# Altium project TemperatureZB.PrjPCB
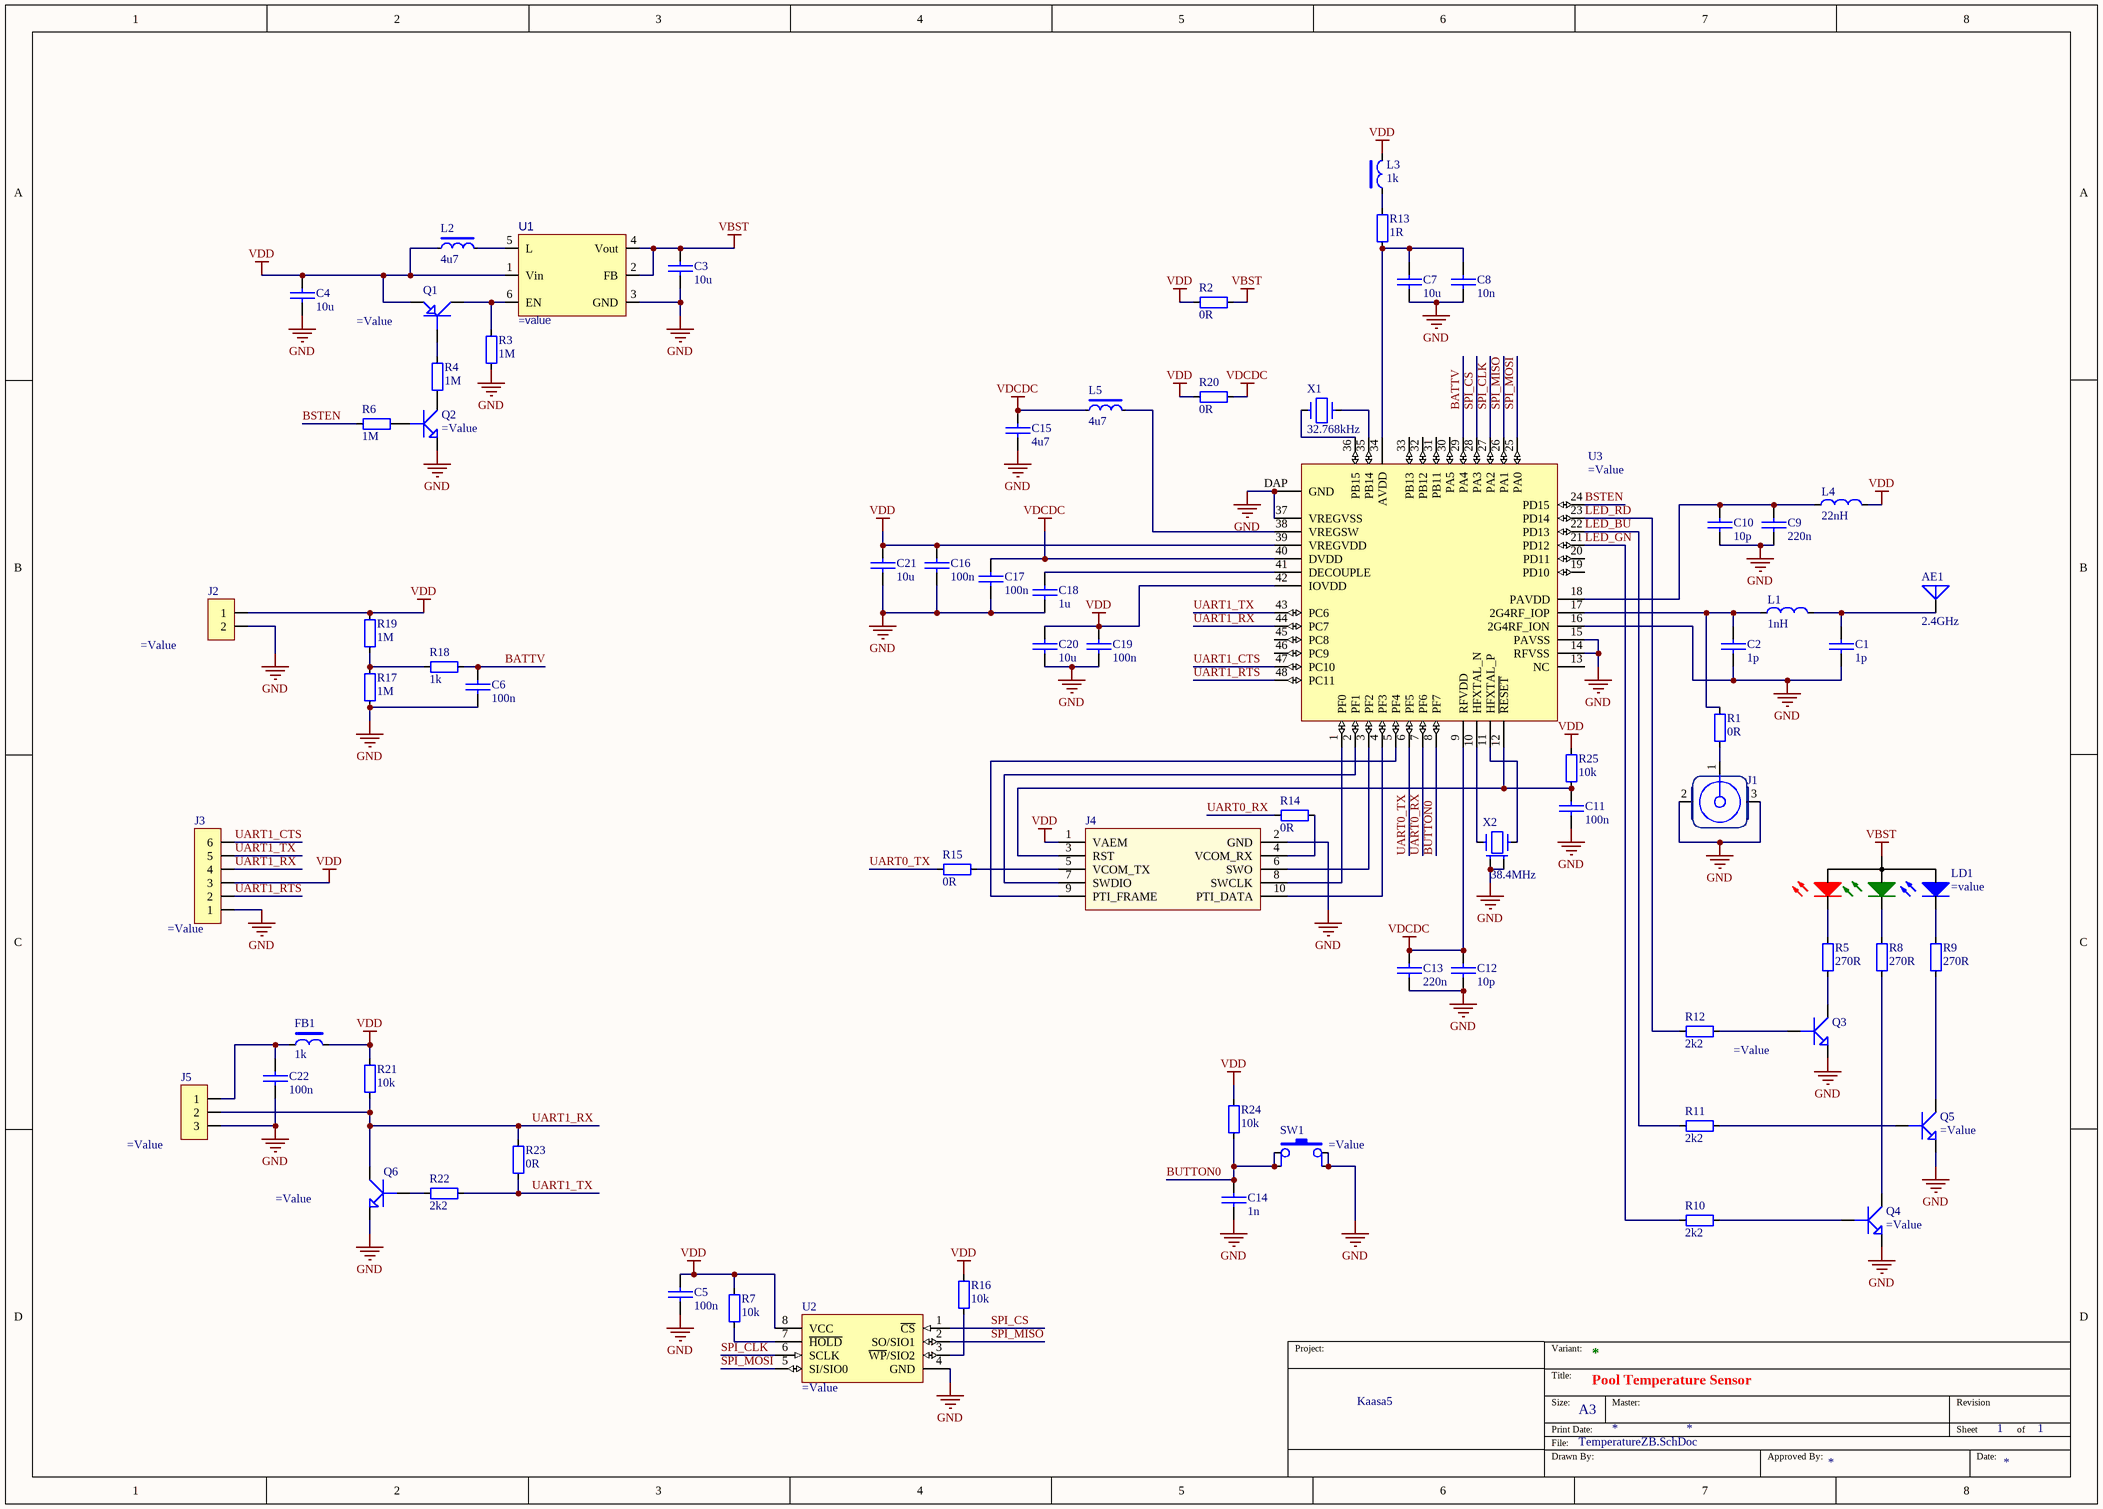
[diagram p0: TemperatureZB.SchDoc]
Drawn By:: Nathan Kuchel
1 sheet, 72 parts. Net scope: global (net labels, ports and power ports of the same name join across sheets).
Board file: TemperatureZB.PcbDoc

## Sheet TemperatureZB.SchDoc: Pool Temperature Sensor
size A3; CompanyName: Kaasa5; DrawnBy: Nathan Kuchel; Organization: Kaasa5; Address1: 1 Chardonnay Blvd; Address2: Reynella, SA, 5161; Revision: 1.0.0; SheetNumber: 1; SheetTotal: 1; SheetTitle: Pool Temperature Sensor

### Parts
AE1  2.4GHz  [ANT2450AT45A100]
C1  1p  [CAPC1005X06N]
C2  1p  [CAPC1005X06N]
C3  10u  [CAPC1005X06N]
C4  10u  [CAPC1005X06N]
C5  100n  [CAPC1005X06N]
C6  100n  [CAPC1005X06N]
C7  10u  [CAPC1005X06N]
C8  10n  [CAPC1005X06N]
C9  220n  [CAPC1005X06N]
C10  10p  [CAPC1005X06N]
C11  100n  [CAPC1005X06N]
C12  10p  [CAPC1005X06N]
C13  220n  [CAPC1005X06N]
C14  1n  [CAPC1005X06N]
C15  4u7  [CAPC1608X09N]
C16  100n  [CAPC1005X06N]
C17  100n  [CAPC1005X06N]
C18  1u  [CAPC1005X06N]
C19  100n  [CAPC1005X06N]
C20  10u  [CAPC1005X06N]
C21  10u  [CAPC1005X06N]
C22  100n  [CAPC1005X06N]
FB1  1k  [INDC1005X06N]
J1  (no value)  [U.FL-LP(V)-040]
J2  (no value)  [S2B-PH-SM4-TB]
J3  (no value)  [HDR1X6]
J4  (no value)  [HDR127MM2X5(noPilot)]  (no BOM)
J5  (no value)  [S3B-PH-SM4-TB]
L1  1nH  [INDC1005X06N]
L2  4u7  [INDC2020X12N]
L3  1k  [INDC1005X06N]
L4  22nH  [INDC1005X06N]
L5  4u7  [INDC2020X12N]
LD1  (no value)  [LEDM3528X190-4N]
Q1  (no value)  [SOT95P230X110-3N]
Q2  (no value)  [SOT95P230X110-3N]
Q3  (no value)  [SOT95P230X110-3N]
Q4  (no value)  [SOT95P230X110-3N]
Q5  (no value)  [SOT95P230X110-3N]
Q6  (no value)  [SOT95P230X110-3N]
R1  0R  [RESC1005X04N]
R2  0R  [RESC1005X04N]
R3  1M  [RESC1005X04N]
R4  1M  [RESC1005X04N]
R5  270R  [RESC1005X04N]
R6  1M  [RESC1005X04N]
R7  10k  [RESC1005X04N]
R8  270R  [RESC1005X04N]
R9  270R  [RESC1005X04N]
R10  2k2  [RESC1005X04N]
R11  2k2  [RESC1005X04N]
R12  2k2  [RESC1005X04N]
R13  1R  [RESC1005X04N]
R14  0R  [RESC1005X04N]
R15  0R  [RESC1005X04N]
R16  10k  [RESC1005X04N]
R17  1M  [RESC1005X04N]
R18  1k  [RESC1005X04N]
R19  1M  [RESC1005X04N]
R20  0R  [RESC1005X04N]
R21  10k  [RESC1005X04N]
R22  2k2  [RESC1005X04N]
R23  0R  [RESC1005X04N]
R24  10k  [RESC1005X04N]
R25  10k  [RESC1005X04N]
SW1  (no value)  [SW450P600x600-4N]
U1  (no value)  [SOT363-6N]
U2  (no value)  [SOIC127P600X175-8N]
U3  (no value)  [QFN50P700X700X80-4846N]
X1  32.768kHz  [XTAL32X15X09]
X2  38.4MHz  [LCCS185P320X250X80-4N]

### Nets
GND: C1.2 C2.2 C3.1 C4.1 C5.2 C6.2 C7.1 C8.2 C9.2 C10.2 C11.2 C12.2 C13.2 C14.2 C15.1 C16.1 C17.2 C18.2 C19.2 C20.2 C21.2 C22.2 J1.2(GND) J1.3(GND) J2.2 J3.1 J4.2(GND) J5.3 Q2.2(E) Q3.2(E) Q4.2(E) Q5.2(E) Q6.2(E) R3.2 R17.1 SW1.2 SW1.4 U1.3(GND) U2.4(GND) U3.14(RFVSS) U3.15(PAVSS) U3.16(2G4RF_ION) U3.37(VREGVSS) U3.DAP(GND) X2.2 X2.4
VBST: C3.2 LD1.4(COM_A) R2.1 U1.2(FB) U1.4(Vout)
VDCDC: C12.1 C13.1 C15.2 C17.1 L5.1 R20.1 U3.9(RFVDD) U3.40(DVDD)
VDD: C4.2 C5.1 C16.2 C19.1 C20.1 C21.1 FB1.1 J2.1 J3.3 J4.1(VAEM) L2.1 L3.2 L4.2 Q1.2(E) R2.2 R7.2 R16.2 R19.2 R20.2 R21.2 R24.1 R25.2 U1.1(Vin) U2.8(VCC) U3.39(VREGVDD) U3.42(IOVDD)
BATTV: C6.1 R18.2 U3.29(PA4)
BSTEN: R6.1 U3.24(PD15)
BUTTON0: C14.1 R24.2 SW1.1 SW1.3 U3.8(PF7)
LED_BU: R11.1 U3.22(PD13)
LED_GN: R10.1 U3.21(PD12)
LED_RD: R12.1 U3.23(PD14)
SPI_CLK: U2.6(SCLK) U3.27(PA2)
SPI_CS: U2.1(~{CS}) U3.28(PA3)
SPI_MISO: U2.2(SO/SIO1) U3.26(PA1)
SPI_MOSI: U2.5(SI/SIO0) U3.25(PA0)
UART0_RX: R14.2 U3.7(PF6)
UART0_TX: R15.1 U3.6(PF5)
UART1_CTS: J3.6 U3.47(PC10)
UART1_RTS: J3.2 U3.48(PC11)
UART1_RX: J3.4 J5.2 Q6.3(C) R21.1 R23.2 U3.44(PC7)
UART1_TX: J3.5 R22.1 R23.1 U3.43(PC6)
NetAE1_1: AE1.1 C1.1 L1.2
NetC2_1: C2.1 L1.1 R1.1 U3.17(2G4RF_IOP)
NetC7_2: C7.2 C8.1 R13.1 U3.34(AVDD)
NetC9_1: C9.1 C10.1 L4.1 U3.18(PAVDD)
NetC11_1: C11.1 J4.3(RST) R25.1 U3.12(~{RESET})
NetC18_1: C18.1 U3.41(DECOUPLE)
NetC22_1: C22.1 FB1.2 J5.1
NetJ1_1: J1.1(Signal) R1.2
NetJ4_4: J4.4(VCOM_RX) R14.1
NetJ4_5: J4.5(VCOM_TX) R15.2
NetJ4_6: J4.6(SWO) U3.3(PF2)
NetJ4_7: J4.7(SWDIO) U3.2(PF1)
NetJ4_8: J4.8(SWCLK) U3.1(PF0)
NetJ4_9: J4.9(PTI_FRAME) U3.5(PF4)
NetJ4_10: J4.10(PTI_DATA) U3.4(PF3)
NetL2_2: L2.2 U1.5(L)
NetL3_1: L3.1 R13.2
NetL5_2: L5.2 U3.38(VREGSW)
NetLD1_1: LD1.1(K_RD) R5.1
NetLD1_2: LD1.2(K_GR) R8.1
NetLD1_3: LD1.3(K_BU) R9.1
NetQ1_1: Q1.1(B) R4.2
NetQ1_3: Q1.3(C) R3.1 U1.6(EN)
NetQ2_1: Q2.1(B) R6.2
NetQ2_3: Q2.3(C) R4.1
NetQ3_1: Q3.1(B) R12.2
NetQ3_3: Q3.3(C) R5.2
NetQ4_1: Q4.1(B) R10.2
NetQ4_3: Q4.3(C) R8.2
NetQ5_1: Q5.1(B) R11.2
NetQ5_3: Q5.3(C) R9.2
NetQ6_1: Q6.1(B) R22.2
NetR7_1: R7.1 U2.7(~{HOLD})
NetR16_1: R16.1 U2.3(~{WP}/SIO2)
NetR17_2: R17.2 R18.1 R19.1
NetU3_10: U3.10(HFXTAL_N) X2.3
NetU3_11: U3.11(HFXTAL_P) X2.1
NetU3_35: U3.35(PB14) X1.2
NetU3_36: U3.36(PB15) X1.1

Not connected (* = marked no-connect by the designer): U3 13(NC) 19(PD10) 20(PD11) 30(PA5) 31(PB11) 32(PB12) 33(PB13) 45(PC8) 46(PC9)

### Notes on the sheet
- Project:
- Variant:
- Title:
- File:
- Drawn By:
- Print Date:
- Size:
- A3
- Master:
- Approved By:
- Sheet
- Revision
- Date:
- of

### Library data of the parts
AE1 = 2450AT45A100E: ANT SMD CER 1dB 3808; Manufacturer: Johanson Technology Inc.; Value: 2.4GHz; ComponentLink1URL: https://www.johansontechnology.com/datasheets/2450AT45A100/2450AT45A100.pdf; ComponentLink1Description: Datasheet; Supplier 1: DigiKey; Supplier Part Number 1: 712-1012-1-ND; PartId: 23; Part Number: 2450AT45A100E; Price: 1.54; PartStatus: Standard
C1 C2 = CC0402BRNPO9BN1R0: CAP SMD CER C0G/NPO ±0.1p 50V 0402; Manufacturer: Yageo; Value: 1p; ComponentLink1URL: www.yageo.com/documents/recent/UPY-GP_NP0_16V-to-50V_17.pdf; ComponentLink1Description: Datasheet; Supplier 1: Element14; Part Number: CC0402BRNPO9BN1R0; PartId: 19; Supplier Part Number 1: 311-3613-1-ND; Price: 0.0226; PartStatus: Standard
C3 C4 C7 C20 C21 = GRM155R60J106ME15D: CAP SMD CER X5R 20% 6.3V 0402; Manufacturer: Murata Electronics; Value: 10u; ComponentLink1URL: https://psearch.en.murata.com/capacitor/product/GRM155R60J106ME15%23.pdf; ComponentLink1Description: Datasheet; Supplier 1: DigiKey; Supplier Part Number 1: 490-13238-1-ND; Part Number: GRM155R60J106ME15D; PartId: 6; Price: 0.235; PartStatus: Standard
C5 C6 C11 C16 C17 C19 C22 = CC0402KRX7R7BB104: CAP SMD CER X7R 10% 16V 0402; Manufacturer: Yageo; Value: 100n; ComponentLink1URL: http://www.yageo.com/documents/recent/UPY-GPHC_X7R_6.3V-to-50V_18.pdf; ComponentLink1Description: Datasheet; Supplier 1: DigiKey; Supplier Part Number 1: 311-1338-1-ND; Part Number: CC0402KRX7R7BB104; PartId: 9; Price: 0.0213; PartStatus: Standard
C8 = CC0402KRX7R9BB103: CAP SMD CER X7R 10% 50V 0402; Manufacturer: Yageo; Value: 10n; ComponentLink1URL: http://www.yageo.com/documents/recent/UPY-GPHC_X7R_6.3V-to-50V_18.pdf; ComponentLink1Description: Datasheet; Supplier 1: DigiKey; Supplier Part Number 1: 311-1349-1-ND; Part Number: CC0402KRX7R9BB103; PartId: 10; Price: 0.0129; PartStatus: Standard
C9 C13 = CL05B224KO5NNNC: CAP SMD CER X7R 10% 16V 0402; Manufacturer: Samsung Electro-Mechanics; Value: 220n; ComponentLink1URL: http://www.samsungsem.com/kr/support/product-search/mlcc/__icsFiles/afieldfile/2019/06/18/CL05B224KO5NNNC-19.pdf; ComponentLink1Description: Datasheet; Supplier 1: DigiKey; Supplier Part Number 1: 1276-1176-1-ND; Part Number: CL05B224KO5NNNC; PartId: 20; Price: 0.0397; PartStatus: Standard
C10 C12 = CC0402JRNPO9BN100: CAP SMD CER C0G/NPO 5% 50V 0402; Manufacturer: Yageo; Value: 10p; ComponentLink1URL: www.yageo.com/documents/recent/UPY-GP_NP0_16V-to-50V_17.pdf; ComponentLink1Description: Datasheet; Supplier 1: DigiKey; Supplier Part Number 1: 311-1014-1-ND; Part Number: CC0402JRNPO9BN100; PartId: 18; Price: 0.0192; PartStatus: Standard
C14 = GRM1555C1H102JA01D: CAP SMD CER C0G/NPO 5% 50V 0402; Manufacturer: Murata Electronics; Value: 1n; ComponentLink1URL: https://search.murata.co.jp/Ceramy/image/img/A01X/G101/ENG/GRM1555C1H102JA01-01.pdf; ComponentLink1Description: Datasheet; Supplier 1: DigiKey; Part Number: GRM1555C1H102JA01D; PartId: 12; Supplier Part Number 1: 490-3244-1-ND; Price: 0.118; PartStatus: Standard
C15 = CL10B475KQ8NQNC: CAP SMD CER X7R 10% 6V3 0603; Manufacturer: Samsung Electro-Mechanics; Value: 4u7; ComponentLink1URL: https://media.digikey.com/pdf/Data%20Sheets/Samsung%20PDFs/CL_Series_MLCC_ds.pdf; ComponentLink1Description: Datasheet; Supplier 1: DigiKey; Supplier Part Number 1: 1276-2087-1-ND; Part Number: CL10B475KQ8NQNC; PartId: 41; Price: 0.197; PartStatus: Standard
C18 = GRM155R70J105KA12J: CAP SMD CER X7R 10% 6.3V 0402; Manufacturer: Murata Electronics; Value: 1u; ComponentLink1URL: https://search.murata.co.jp/Ceramy/image/img/A01X/G101/ENG/GRM155R70J105KA12-01.pdf; ComponentLink1Description: Datasheet; Supplier 1: DigiKey; Supplier Part Number 1: 490-13339-1-ND; Part Number: GRM155R70J105KA12J; PartId: 8; Price: 0.0554; PartStatus: Standard
FB1 L3 = BK1005HS102-T: FER BEAD SMD ±25% 300mA 0402; Manufacturer: Taiyo Yuden; Part Number: BK1005HS102-T; PartId: 11; Value: 1k; ComponentLink1Description: Datasheet; ComponentLink1URL: https://www.yuden.co.jp/productdata/catalog/mlci07_e.pdf; Supplier 1: DigiKey; Supplier Part Number 1: 587-1841-1-ND; Price: 0.0494; PartStatus: Standard
J1 = 1909763-1: CON SMD VERT RF U.FL; Manufacturer: TE Connectivity AMP Connectors; Part Number: 1909763-1; PartId: 42; Value: 1909763-1; ComponentLink1Description: Datasheet; ComponentLink1URL: https://www.te.com/commerce/DocumentDelivery/DDEController?Action=srchrtrv&DocNm=1909763&DocType=Customer+Drawing&DocLang=English; Supplier 1: DigiKey; Supplier Part Number 1: A118077CT-ND; Price: 0.43; PartStatus: Standard
J2 = S2B-PH-SM4-TB(LF)(SN): CON SMD RIGHT ANGLE 100V 2A 2x5pin; Manufacturer: JST Sales America Inc.; PartId: 37; Value: S2B-PH-SM4-TB(LF)(SN); Part Number: S2B-PH-SM4-TB(LF)(SN); ComponentLink1Description: Datasheet; ComponentLink1URL: http://www.jst-mfg.com/product/pdf/eng/ePH.pdf; Supplier 1: DigiKey; Supplier Part Number 1: 455-1749-1-ND; Price: 0.89; PartStatus: Standard
J3 = 68000-406HLF: CON THRU Vertical 1A Header 1x6pin; Manufacturer: Amphenol 87; Part Number: 68000-406HLF; PartId: 43; Value: 68000-406HLF; ComponentLink1Description: Datasheet; ComponentLink1URL: https://cdn.amphenol-icc.com/media/wysiwyg/files/drawing/68000.pdf; Supplier 1: DigiKey; Supplier Part Number 1: 609-3263-ND; Price: 0.375; PartStatus: Standard
J4 = GRPB052VWQS-RC: CON SMD 1A 2x5pin; Manufacturer: Sullins Connector Solutions; Value: SIMPLICITY_Debug; ComponentLink1URL: https://s3.amazonaws.com/catalogspreads-pdf/PAGE94-95%20.050%20MALE%20HDR%20ST%20RA%20SMT.pdf; ComponentLink1Description: Datasheet; Supplier 1: DigiKey; Part Number: GRPB052VWQS-RC; PartId: 25; ComponentLink2Description: Drawing; ComponentLink2URL: https://drawings-pdf.s3.amazonaws.com/10958.pdf; Supplier Part Number 1: S9012E-05-ND; Price: 1.57; PartStatus: Standard
J5 = S3B-PH-SM4-TB(LF)(SN): CON SMD RIGHT ANGLE 100V 2A Header 1x3pin; Manufacturer: JST Sales America Inc.; Part Number: S3B-PH-SM4-TB(LF)(SN); PartId: 44; Value: S3B-PH-SM4-TB(LF)(SN); ComponentLink1Description: Datasheet; ComponentLink1URL: http://www.jst-mfg.com/product/pdf/eng/ePH.pdf; Supplier 1: DigiKey; Supplier Part Number 1: 455-1750-1-ND; Price: 1.05; PartStatus: Standard
L1 = AISC-0402-1N0J-T: IND SMD UnShielded W/W 5% 1.36A 0402; Manufacturer: Abracon LLC; Value: 1nH; ComponentLink1URL: https://abracon.com/Magnetics/new/AISC-0402.pdf; ComponentLink1Description: Datasheet; Supplier 1: DigiKey; Supplier Part Number 1: 535-10423-1-ND; Part Number: AISC-0402-1N0J-T; PartId: 22; ComponentLink2URL: https://abracon.com/Support/PackageDrawing/Magnetics/AISC-0402.PDF; Price: 0.51; PartStatus: Standard
L2 L5 = NRV2012T4R7MGF: IND SMD UnShielded W/W 5% 750mA 2010; Manufacturer: Taiyo Yuden; PartId: 40; Value: 4u7; Part Number: NRV2012T4R7MGF; ComponentLink1Description: Datasheet; ComponentLink1URL: https://www.yuden.co.jp/productdata/catalog/wound04_e.pdf; Supplier 1: DigiKey; Supplier Part Number 1: 587-4705-1-ND; Price: 0.359; PartStatus: Standard
L4 = LQG15HS22NJ02D: IND SMD UnShielded Multi-Layer 5% 350mA 0402; Manufacturer: Murata Electronics; Value: 22nH; ComponentLink1URL: https://psearch.en.murata.com/inductor/product/LQG15HS22NJ02_.pdf; ComponentLink1Description: Datasheet; Supplier 1: DigiKey; Supplier Part Number 1: 490-2627-1-ND; Part Number: LQG15HS22NJ02D; PartId: 21; ComponentLink2Description: Catalogue; ComponentLink2URL: https://search.murata.co.jp/Ceramy/image/img/P02/JELF243B-0010.pdf; Price: 0.091; PartStatus: Standard
LD1 = ASMB-MTB1-0A3A2: LED SMD 540mcd Red, 1600mcd Green, 350mcd Blue 4PLCC; Manufacturer: Broadcom Limited; Value: ASMB-MTB1-0A3A2; ComponentLink1URL: https://docs.broadcom.com/docs/AV02-4194EN; ComponentLink1Description: Datasheet; Supplier 1: DigiKey; PartId: 28; Part Number: ASMB-MTB1-0A3A2; Supplier Part Number 1: 516-3280-1-ND; Price: 0.94; PartStatus: Standard
Q1 = MMBT3906,215: TRANS SMD BJT PNP 40V 0.2A SOT23; Manufacturer: Nexperia USA Inc.; PartId: 30; Value: MMBT3906,215; Part Number: MMBT3906,215; ComponentLink1Description: Datasheet; ComponentLink1URL: https://assets.nexperia.com/documents/data-sheet/MMBT3906.pdf; Supplier 1: DigiKey; Supplier Part Number 1: 1727-4045-1-ND; Price: 0.191; PartStatus: Standard
Q2-Q6 = MMBT3904,215: TRANS SMD BJT NPN 40V 0.2A SOT23; Manufacturer: Nexperia USA Inc.; Value: MMBT3904,215; ComponentLink1URL: https://assets.nexperia.com/documents/data-sheet/MMBT3904.pdf; ComponentLink1Description: Datasheet; Supplier 1: DigiKey; Supplier Part Number 1: 1727-4044-1-ND; PartId: 29; Part Number: MMBT3904,215; Price: 0.145; PartStatus: Standard
R1 R2 R14 R15 R20 R23 = RC0402FR-070RL: RES SMD Think Film 1% 1/16W 1A 100V 0402; Manufacturer: Yageo; Value: 0R; ComponentLink1URL: http://www.yageo.com/documents/recent/PYu-RC_Group_51_RoHS_L_10.pdf; ComponentLink1Description: Datasheet; Supplier 1: DigiKey; Supplier Part Number 1: 311-0.0LRCT-ND; Part Number: RC0402FR-070RL; PartId: 17; Price: 0.009; PartStatus: Standard
R3 R4 R6 R17 R19 = RC0402FR-071ML: RES SMD Think Film 1% 1/16W 50V 0402; Manufacturer: Yageo; Value: 1M; ComponentLink1URL: http://www.yageo.com/documents/recent/PYu-RC_Group_51_RoHS_L_10.pdf; ComponentLink1Description: Datasheet; Supplier 1: DigiKey; Supplier Part Number 1: 311-1.00MLRCT-ND; Part Number: RC0402FR-071ML; PartId: 38; Price: 0.0102; PartStatus: Standard
R5 R8 R9 = RC0402FR-07270RL: RES SMD Think Film 1% 1/16W 100V 0402; Manufacturer: Yageo; Value: 270R; ComponentLink1URL: http://www.yageo.com/documents/recent/PYu-RC_Group_51_RoHS_L_10.pdf; ComponentLink1Description: Datasheet; Supplier 1: DigiKey; Supplier Part Number 1: 311-270LRCT-ND; Part Number: RC0402FR-07270RL; PartId: 16; Price: 0.01; PartStatus: Standard
R7 R16 R21 R24 R25 = RC0402FR-0710KL: RES SMD Think Film 1% 1/16W 100V 0402; Manufacturer: Yageo; Value: 10k; ComponentLink1URL: http://www.yageo.com/documents/recent/PYu-RC_Group_51_RoHS_L_10.pdf; ComponentLink1Description: Datasheet; Supplier 1: DigiKey; Supplier Part Number 1: 311-10.0KLRCT-ND; Part Number: RC0402FR-0710KL; PartId: 4; Price: 0.01; PartStatus: Standard
R10-R12 R22 = RC0402FR-072K2L: RES SMD Think Film 1% 1/16W 50V 0402; Manufacturer: Yageo; PartId: 31; Value: 2k2; Part Number: RC0402FR-072K2L; ComponentLink1Description: Datasheet; ComponentLink1URL: http://www.yageo.com/documents/recent/PYu-RC_Group_51_RoHS_L_10.pdf; Supplier 1: DigiKey; Supplier Part Number 1: 311-2.20KLRCT-ND; Price: 0.102; PartStatus: Standard
R13 = RC0402FR-071RL: RES SMD Think Film 1% 1/16W 100V 0402; Manufacturer: Yageo; Value: 1R; ComponentLink1URL: http://www.yageo.com/documents/recent/PYu-RC_Group_51_RoHS_L_10.pdf; ComponentLink1Description: Datasheet; Supplier 1: DigiKey; Supplier Part Number 1: 311-1.00LRCT-ND; Part Number: RC0402FR-071RL; PartId: 5; Price: 0.0151; PartStatus: Standard
R18 = RC0402FR-071KL: RES SMD Think Film 1% 1/16W 100V 0402; Manufacturer: Yageo; Part Number: RC0402FR-071KL; PartId: 1; Value: 1k; ComponentLink1Description: Datasheet; ComponentLink1URL: http://www.yageo.com/documents/recent/PYu-RC_Group_51_RoHS_L_10.pdf; Supplier 1: DigiKey; Supplier Part Number 1: 311-1.00KLRCT-ND; Price: 0.01; PartStatus: Standard
SW1 = PTS645SK50SMTR92 LFS: SWITCH SMD TACTILE PUSH BUTTON SPST-NO 12V 50mA GULLWING; Manufacturer: C&K Components; PartId: 45; Value: PTS645SK50SMTR92 LFS; Part Number: PTS645SK50SMTR92 LFS; ComponentLink1Description: Datasheet; ComponentLink1URL: https://www.ckswitches.com/products/tactile/PTS645/PTS645SK50SMTR92LFS; Supplier 1: DigiKey; Supplier Part Number 1: CKN9087CT-ND; Price: 0.4; PartStatus: Standard
U1 = TPS61222DCKR: IC SMD BOOST CONV 5V 200mA SC70-6; Manufacturer: Texas Instruments; Part Number: TPS61222DCKR; PartId: 36; Value: TPS61222DCKR; ComponentLink1Description: Datasheet; ComponentLink1URL: http://www.ti.com/lit/ds/symlink/tps61220.pdf; Supplier 1: DigiKey; Supplier Part Number 1: 296-39435-1-ND; Price: 1.74; PartStatus: Standard
U2 = MX25R8035FM1IH1: IC SMD FLASH SPI 8Mb (1M x 8) SOP8; Manufacturer: Macronix; Value: MX25R8035FM1IH1; ComponentLink1URL: https://www.macronix.com/Lists/Datasheet/Attachments/7461/MX25R8035F,%20Wide%20Range,%208Mb,%20v1.6.pdf; ComponentLink1Description: Datasheet; Supplier 1: DigiKey; Supplier Part Number 1: 1092-1180-ND; PartId: 34; Part Number: MX25R8035FM1IH1; Price: 0.81; PartStatus: Standard
U3 = EFR32MG12P332F1024GM48-B: SoC Bluetooth CORTEX-M4 48MHz 1Mb Flash 256kb RAM QFN48; Manufacturer: Silicon Labs; Part Number: EFR32MG12P332F1024GM48-B; PartId: 3; Value: EFR32MG12P332F1024GM48-B; ComponentLink1Description: Datasheet; ComponentLink1URL: https://www.silabs.com/documents/public/data-sheets/efr32mg12-datasheet.pdf; Supplier 1: DigiKey; Supplier Part Number 1: 336-5495-ND; Price: 13.3; PartStatus: Standard
X1 = FC-135 32.7680KA-A5: XTL SMD ±20ppm 12.5pF SMD-2; Manufacturer: EPSON; Value: 32.768kHz; ComponentLink1URL: https://support.epson.biz/td/api/doc_check.php?dl=brief_FC-135&lang=en; ComponentLink1Description: Datasheet; Supplier 1: DigiKey; Supplier Part Number 1: SER4103CT-ND; Part Number: FC-135 32.7680KA-A5; PartId: 14; Price: 0.515; PartStatus: Standard
X2 = TSX-3225 38.4000MF10Z-AS3: XTL SMD ±10ppm  8.5pF SMD-4; Manufacturer: EPSON; Value: 38.4MHz; ComponentLink1URL: https://support.epson.biz/td/api/doc_check.php?dl=brief_TSX-3225&lang=en; ComponentLink1Description: Datasheet; Supplier 1: DigiKey; Supplier Part Number 1: SER3625CT-ND; Part Number: TSX-3225 38.4000MF10Z-AS3; PartId: 13; Price: 0.454; PartStatus: Standard